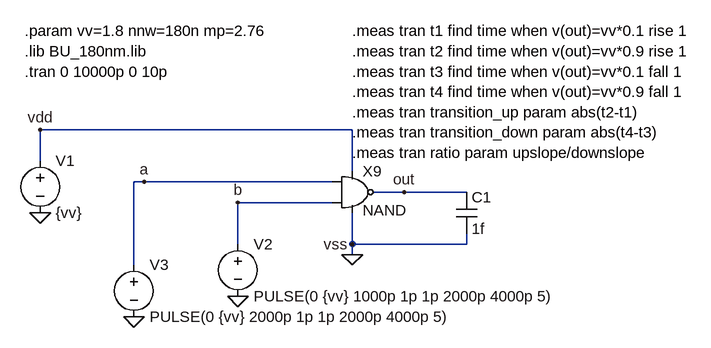
[diagram p0: schematic nand_test.asc]
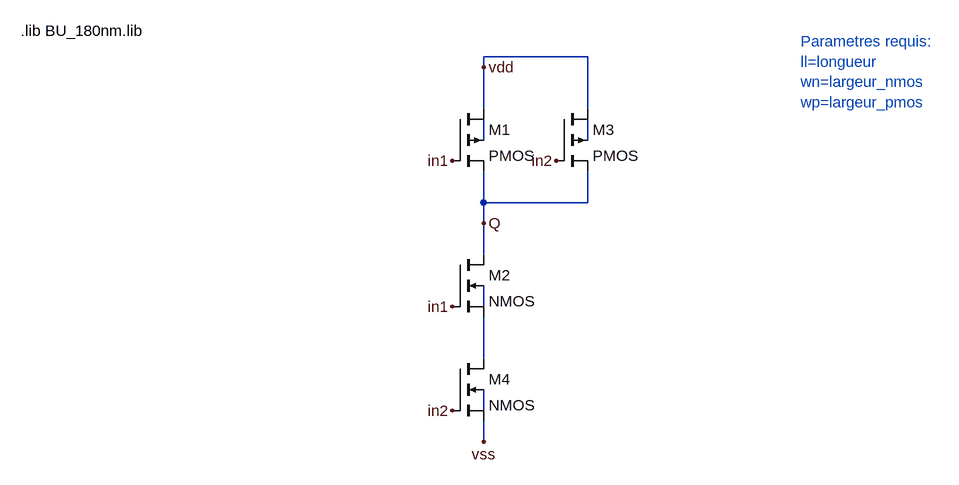
[diagram p1: sub-circuit nand.asc]
nand_test.asc, the LTspice schematic file:
Version 4
SHEET 1 1168 680
WIRE 416 224 -64 224
WIRE -64 272 -64 224
WIRE 416 288 416 224
WIRE 96 304 80 304
WIRE 384 304 96 304
WIRE 496 320 448 320
WIRE 592 320 496 320
WIRE 384 336 240 336
WIRE 240 400 240 336
WIRE 416 400 416 352
WIRE 592 400 592 384
WIRE 592 400 416 400
WIRE 416 416 416 400
WIRE 80 432 80 304
FLAG -64 352 0
FLAG 240 480 0
FLAG 416 416 0
FLAG -64 224 vdd
FLAG 416 400 vss
FLAG 240 336 b
FLAG 496 320 out
FLAG 80 512 0
FLAG 96 304 a
DATAFLAG 32 224 ""
SYMBOL /voltage -64 256 R0
SYMATTR InstName V1
SYMATTR Value {vv}
SYMBOL /voltage 240 384 R0
SYMATTR InstName V2
SYMATTR Value PULSE(0 {vv} 1000p 1p 1p 2000p 4000p 5)
SYMBOL nand 416 320 R0
SYMATTR InstName X9
SYMATTR SpiceLine ll=180n wn={nnw} wp={nnw*mp}
SYMBOL /voltage 80 416 R0
SYMATTR InstName V3
SYMATTR Value PULSE(0 {vv} 2000p 1p 1p 2000p 4000p 5)
SYMBOL cap 576 320 R0
SYMATTR InstName C1
SYMATTR Value 1f
TEXT -88 72 Left 2 !.param vv=1.8 nnw=180n mp=2.76\n.lib BU_180nm.lib\n.tran 0 10000p 0 10p
TEXT 416 72 Left 2 !.meas tran t1 find time when v(out)=vv*0.1 rise 1\n.meas tran t2 find time when v(out)=vv*0.9 rise 1\n.meas tran t3 find time when v(out)=vv*0.1 fall 1\n.meas tran t4 find time when v(out)=vv*0.9 fall 1\n.meas tran transition_up param abs(t2-t1)\n.meas tran transition_down param abs(t4-t3)\n.meas tran ratio param upslope/downslope

nand.asc, the sub-circuit schematic file:
Version 4
SHEET 1 1192 836
WIRE 608 160 448 160
WIRE 448 176 448 160
WIRE 448 240 448 176
WIRE 608 240 608 160
WIRE 448 288 448 256
WIRE 608 288 608 256
WIRE 448 384 448 336
WIRE 608 384 608 336
WIRE 608 384 448 384
WIRE 448 416 448 384
WIRE 448 464 448 416
WIRE 448 544 448 512
WIRE 448 624 448 560
WIRE 448 704 448 672
WIRE 448 752 448 720
FLAG 448 176 vdd
FLAG 448 416 Q
FLAG 400 320 in1
FLAG 560 320 in2
FLAG 400 544 in1
FLAG 400 704 in2
FLAG 448 752 vss
SYMBOL pmos4 400 240 R0
SYMATTR InstName M1
SYMATTR Value2 l={ll} w={wp} ad={450n*{wp}} as={450n*{wp}} pd={900n+{wp}} ps={1080n+{wp}}
SYMBOL pmos4 560 240 R0
SYMATTR InstName M3
SYMATTR Value2 l={ll} w={wp} ad={450n*{wp}} as={450n*{wp}} pd={900n+{wp}} ps={1080n+{wp}}
SYMBOL nmos4 400 464 R0
SYMATTR InstName M2
SYMATTR Value2 l={ll} w={2*wn} ad={450n*{wn}} as={450n*{wn}} pd={900n+{wn}} ps={1080n+{wn}}
SYMBOL nmos4 400 624 R0
SYMATTR InstName M4
SYMATTR Value2 l={ll} w={2*wn} ad={450n*{wn}} as={450n*{wn}} pd={900n+{wn}} ps={1080n+{wn}}
TEXT -264 120 Left 2 !.lib BU_180nm.lib
TEXT 936 136 Left 2 ;Parametres requis: \nll=longueur \nwn=largeur_nmos \nwp=largeur_pmos

The netlist it stands for:
* nand_test.asc
V1 vdd 0 {vv}
V2 b 0 PULSE(0 {vv} 1000p 1p 1p 2000p 4000p 5)
XX9 a out vdd 0 b nand params: NAND ll=180n wn={nnw} wp={nnw*mp}
V3 a 0 PULSE(0 {vv} 2000p 1p 1p 2000p 4000p 5)
C1 out 0 1f

* block symbol definitions
.subckt nand in1 Q vdd vss in2
M1 vdd in1 Q N001 PMOS l={ll} w={wp} ad={450n*{wp}} as={450n*{wp}} pd={900n+{wp}} ps={1080n+{wp}}
M3 vdd in2 Q N002 PMOS l={ll} w={wp} ad={450n*{wp}} as={450n*{wp}} pd={900n+{wp}} ps={1080n+{wp}}
M2 Q in1 N004 N003 NMOS l={ll} w={2*wn} ad={450n*{wn}} as={450n*{wn}} pd={900n+{wn}} ps={1080n+{wn}}
M4 N004 in2 vss N005 NMOS l={ll} w={2*wn} ad={450n*{wn}} as={450n*{wn}} pd={900n+{wn}} ps={1080n+{wn}}
.lib BU_180nm.lib
* Parametres requis:
* ll=longueur
* wn=largeur_nmos
* wp=largeur_pmos
.ends nand

.model NMOS NMOS
.model PMOS PMOS
.lib standard.mos
.param vv=1.8 nnw=180n mp=2.76
.lib BU_180nm.lib
.tran 0 10000p 0 10p
.meas tran t1 find time when v(out)=vv*0.1 rise 1
.meas tran t2 find time when v(out)=vv*0.9 rise 1
.meas tran t3 find time when v(out)=vv*0.1 fall 1
.meas tran t4 find time when v(out)=vv*0.9 fall 1
.meas tran transition_up param abs(t2-t1)
.meas tran transition_down param abs(t4-t3)
.meas tran ratio param upslope/downslope
.backanno
.end